# EAGLE design Xia_ENGI301_PCB (EAGLE 9.6.1)
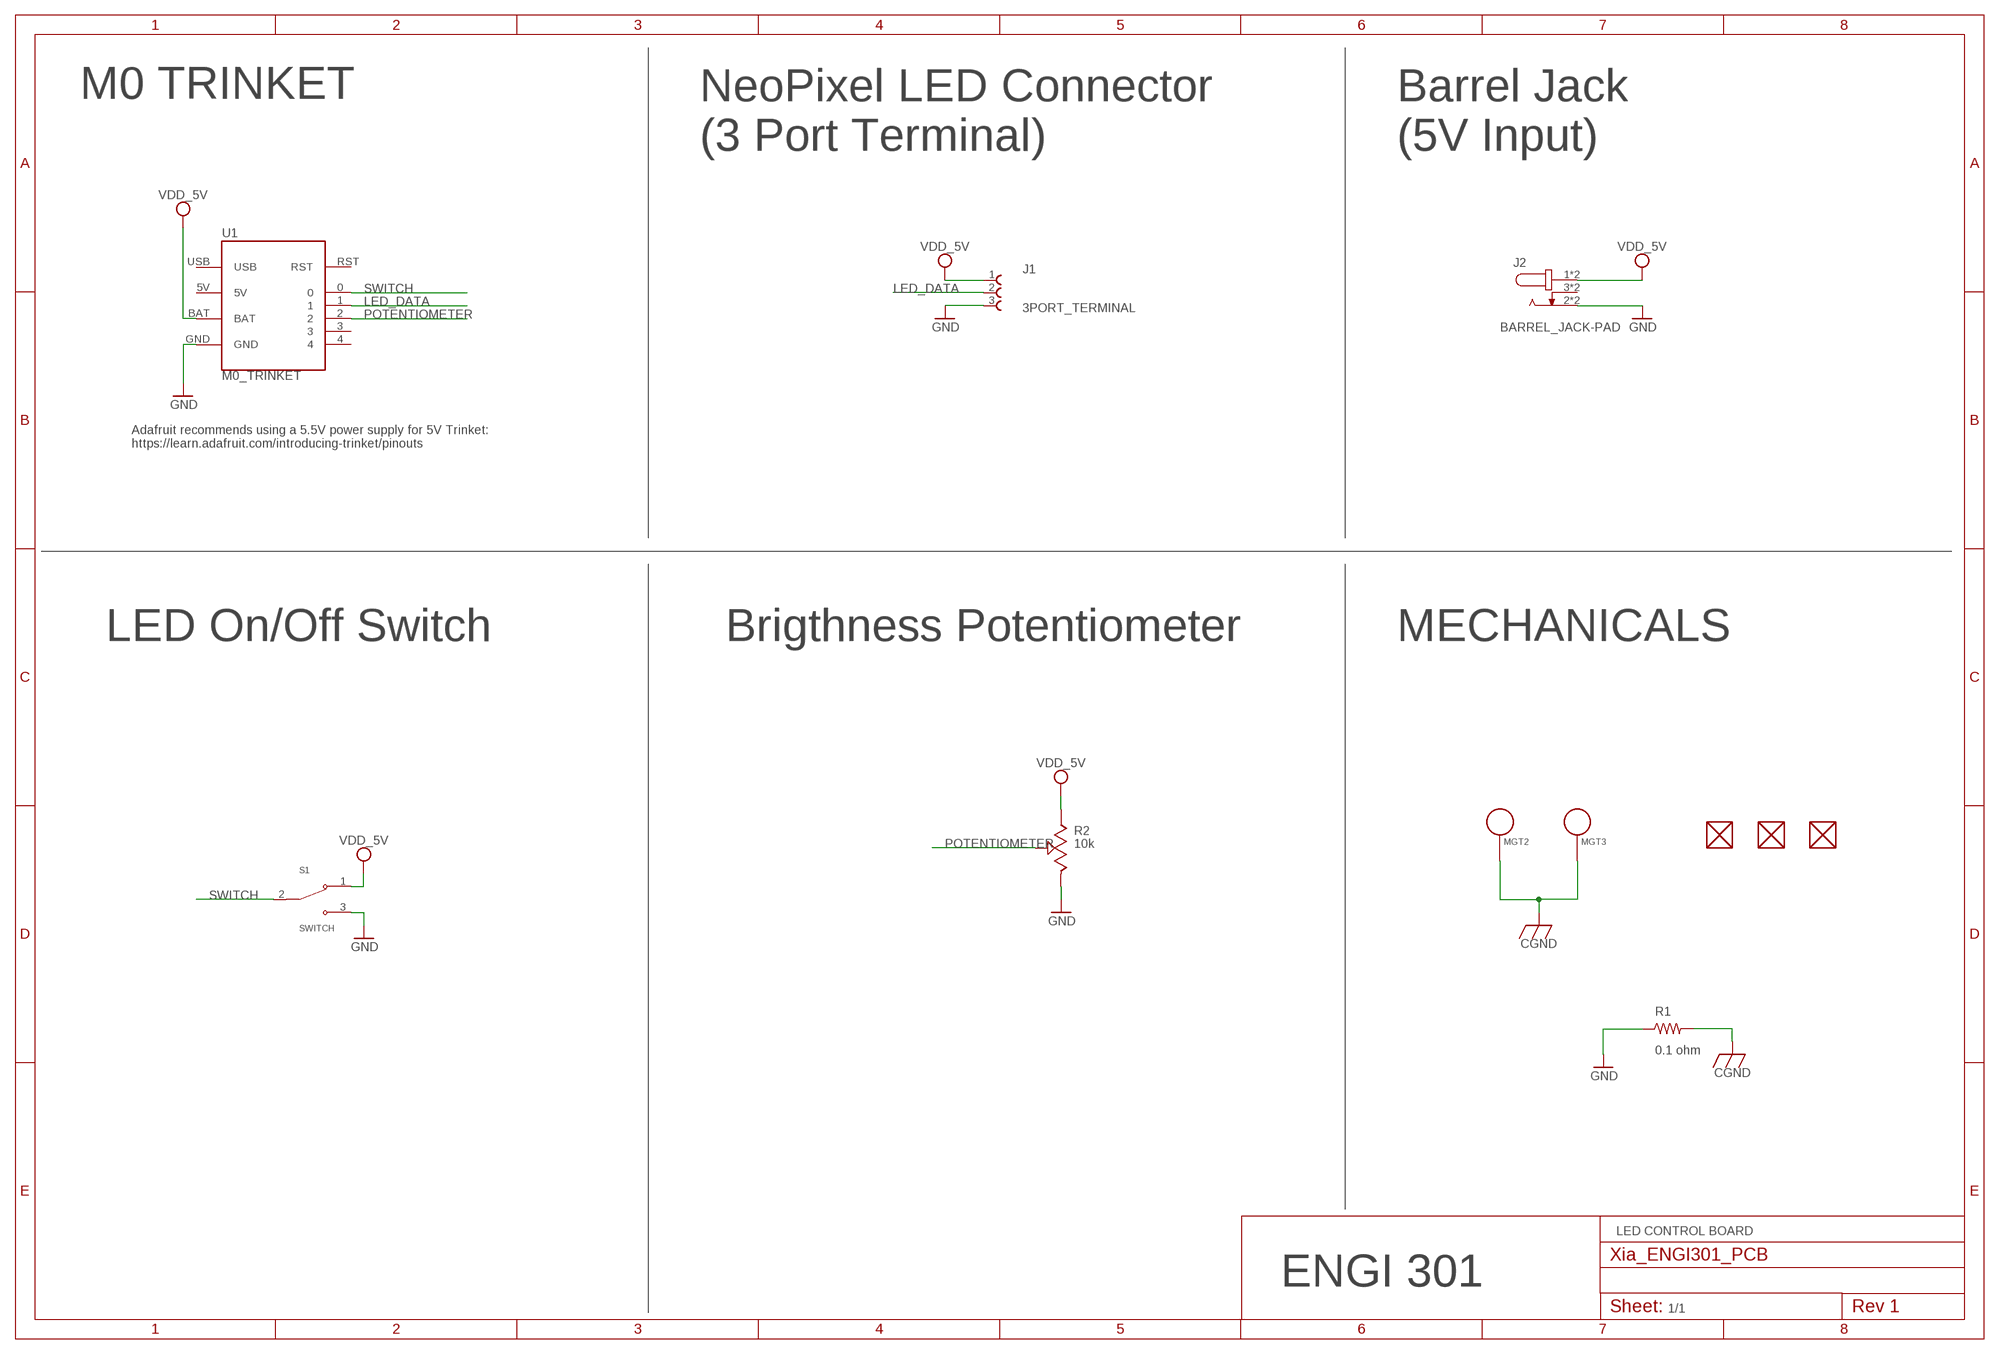
[diagram p0: schematic, sheet 1]

## Parts
FUD1  FIDUCIAL  [FIDUCIAL_40MIL]
FUD2  FIDUCIAL  [FIDUCIAL_40MIL]
FUD3  FIDUCIAL  [FIDUCIAL_40MIL]
J1  3PORT_TERMINAL  [3PORT_TERMINAL]
J2  BARREL_JACK-PAD  [BARREL_JACK]
MGT2  MOUNTING_HOLE  [MOUNTING_HOLE]
MGT3  MOUNTING_HOLE  [MOUNTING_HOLE]
R1  0.1 ohm  R-US_0207/10  [0207/10]
R2  10k  POTENTIOMETER  [POTENTIOMETER]
S1  SWITCH  [SWITCH]
U1  M0_TRINKET  [M0_TRINKET]

## Nets
CGND: MGT2.P$1 MGT3.P$1 R1.2
GND: J1.3 J2.2 J2.2_B R1.1 R2.3 S1.3 U1.GND
LED_DATA: J1.2 U1.1
POTENTIOMETER: R2.2 U1.2
SWITCH: S1.2 U1.0
VDD_5V: J1.1 J2.1 J2.1_B R2.1 S1.1 U1.BAT
Unconnected: FUD1.P$1 FUD2.P$1 FUD3.P$1 J2.3 J2.3_B U1.3 U1.4 U1.RST U1.USB

## Notes on the sheet
- M0 TRINKET
- NeoPixel LED Connector
  (3 Port Terminal)
- Barrel Jack
  (5V Input)
- Adafruit recommends using a 5.5V power supply for 5V Trinket:
  https://learn.adafruit.com/introducing-trinket/pinouts
- LED On/Off Switch | Brigthness Potentiometer | MECHANICALS
- LED CONTROL BOARD
- ENGI 301
- 1/1

## Power pins joined to a net without a drawn wire
5V: U1.5V

## Library data of the parts
FUD1-FUD3 = combo_lock:FIDUCIAL
J1 = Xia_ENGI301_PCB:3PORT_TERMINAL: SERIE 1377 - 5.00 MM - HORIZONTAL CABLE ENTRY WITH PRESSURE CLAMP - GLOW WIRE PLASTIC - WR-TBL <http://katalog.we-online.de/media/images/v2/Family_WR-TBL1_6911377100xx.jpg> Details see: http://katalog.we-online.de/en/em/TBL_5_00_1377_HORIZONTAL_ENTRY_W_PRESSURE_CLAMP_GLOW_WIRE_6911377100xx Created by Yingchun,Shan 2016(C) Wurth Elektronik Check availability <https://pricing.snapeda.com/parts/691137710003/Wurth%20Elektronik/view-part?ref=eda>; AVAILABILITY: In Stock; DESCRIPTION: 3 Position Wire to Board Terminal Block Horizontal with Board 0.197 (5.00mm) Through Hole; MF: Wurth Elektronik; MP: 691137710003; PACKAGE: None; PRICE: None; PURCHASE-URL: https://pricing.snapeda.com/search/part/691137710003/?ref=eda
J2 = Xia_ENGI301_PCB:BARREL_JACK: 2.5 mm Center Pin, 5.0 A, Right Angle, Through Hole, Tapered Pins, Dc Power Jack Connector; MANUFACTURER: CUI INC; PART_REV: 1.02; STANDARD: Manufacturer recommendations
MGT2 MGT3 = combo_lock:MOUNTING_HOLE: Chassis Mounting Hole w/GND connection ability
R1 = Xia_ENGI301_PCB:R-US_: RESISTOR, American symbol
R2 = Xia_ENGI301_PCB:POTENTIOMETER
S1 = Xia_ENGI301_PCB:SWITCH: Toggle Switch SPDT Through Hole Check availability <https://pricing.snapeda.com/parts/100SP1T1B4M2QE/E-Switch/view-part?ref=eda>; AVAILABILITY: In Stock; DESCRIPTION: Toggle Switch SPDT Through Hole; MF: E-Switch; MP: 100SP1T1B4M2QE; PACKAGE: None; PRICE: None; PURCHASE-URL: https://pricing.snapeda.com/search/part/100SP1T1B4M2QE/?ref=eda
U1 = Xia_ENGI301_PCB:M0_TRINKET

## Board
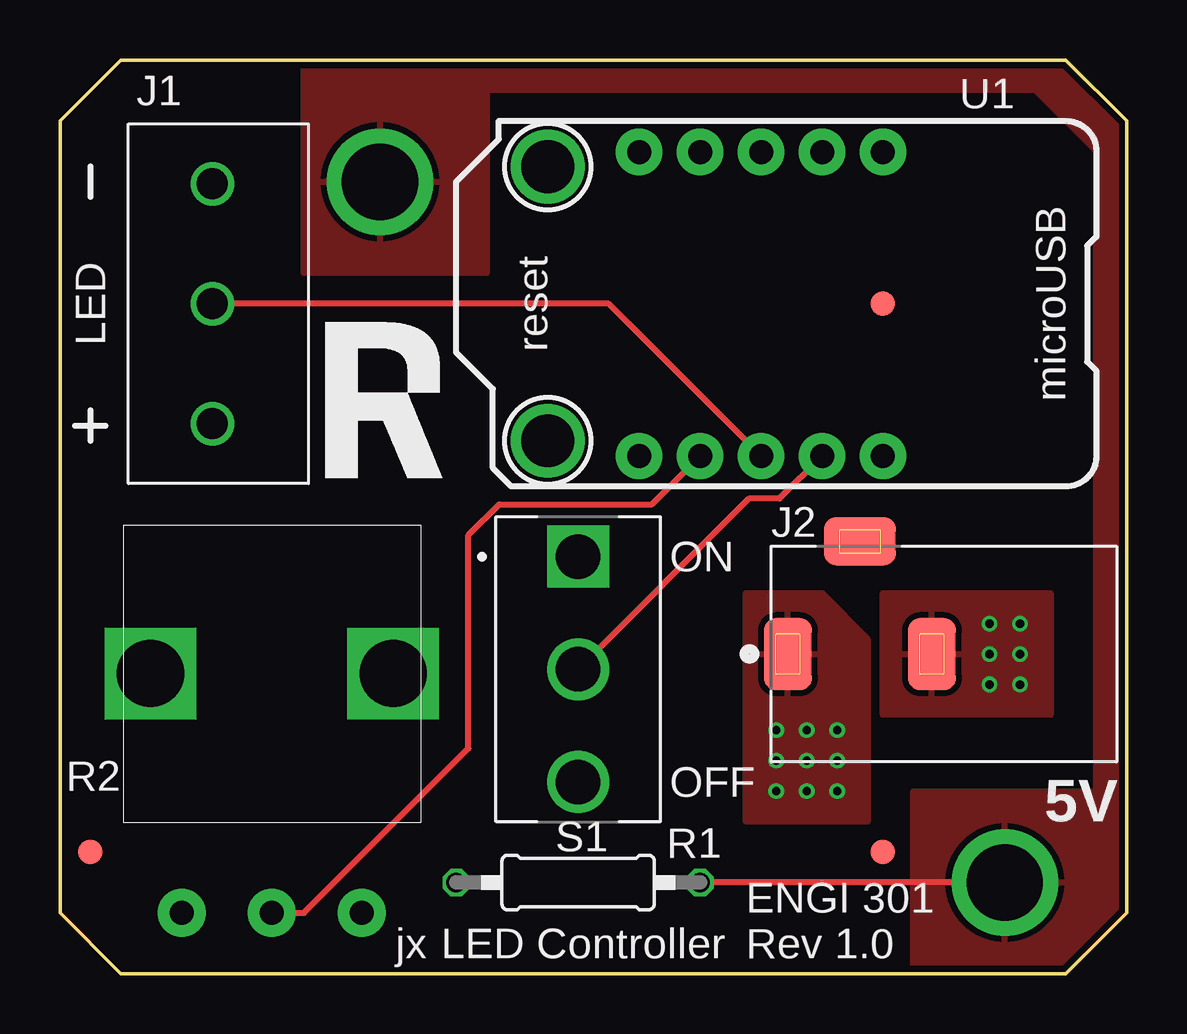
[diagram p1: board, top side]
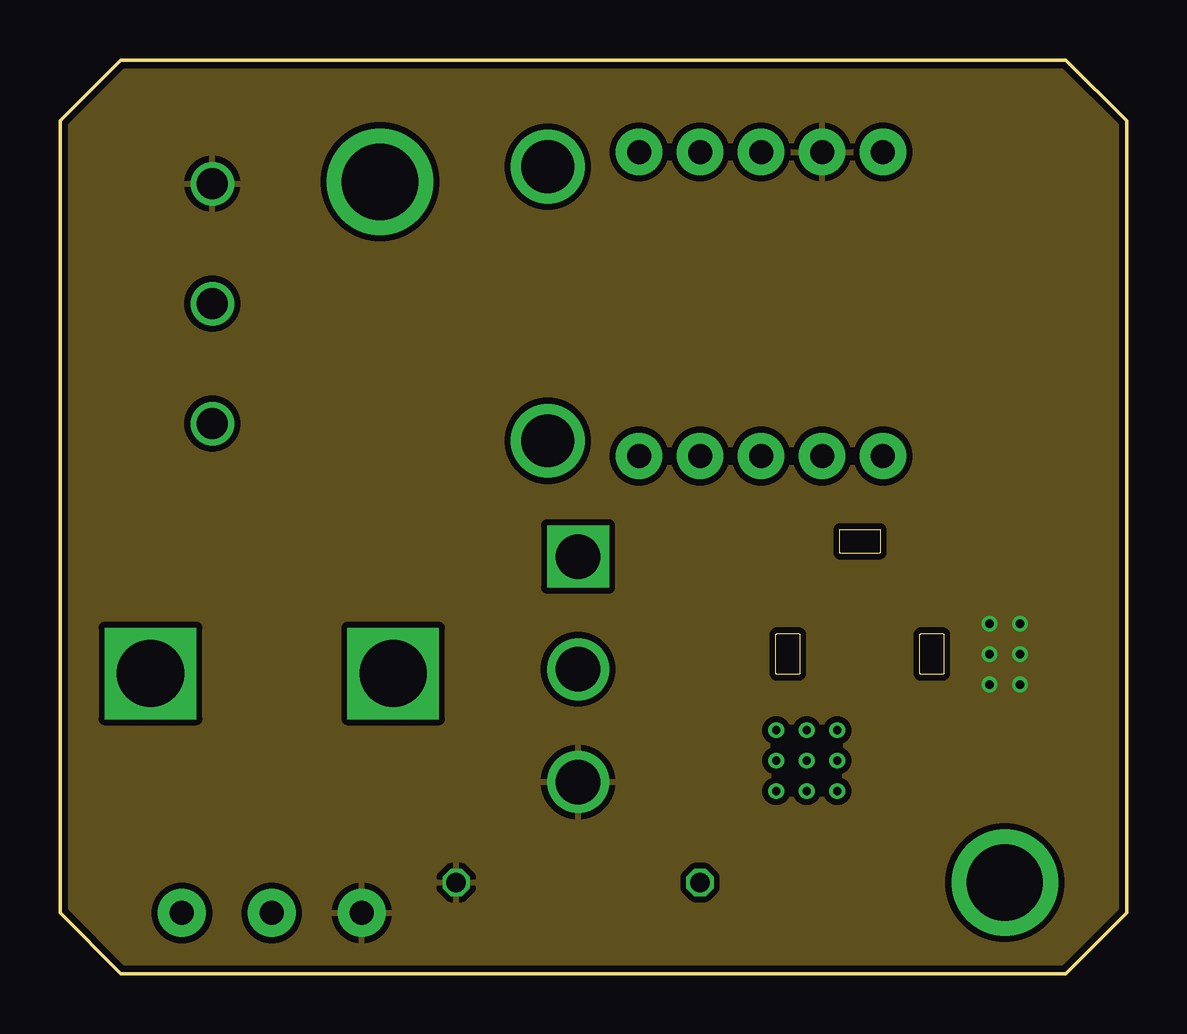
[diagram p2: board, inner layer Route2]
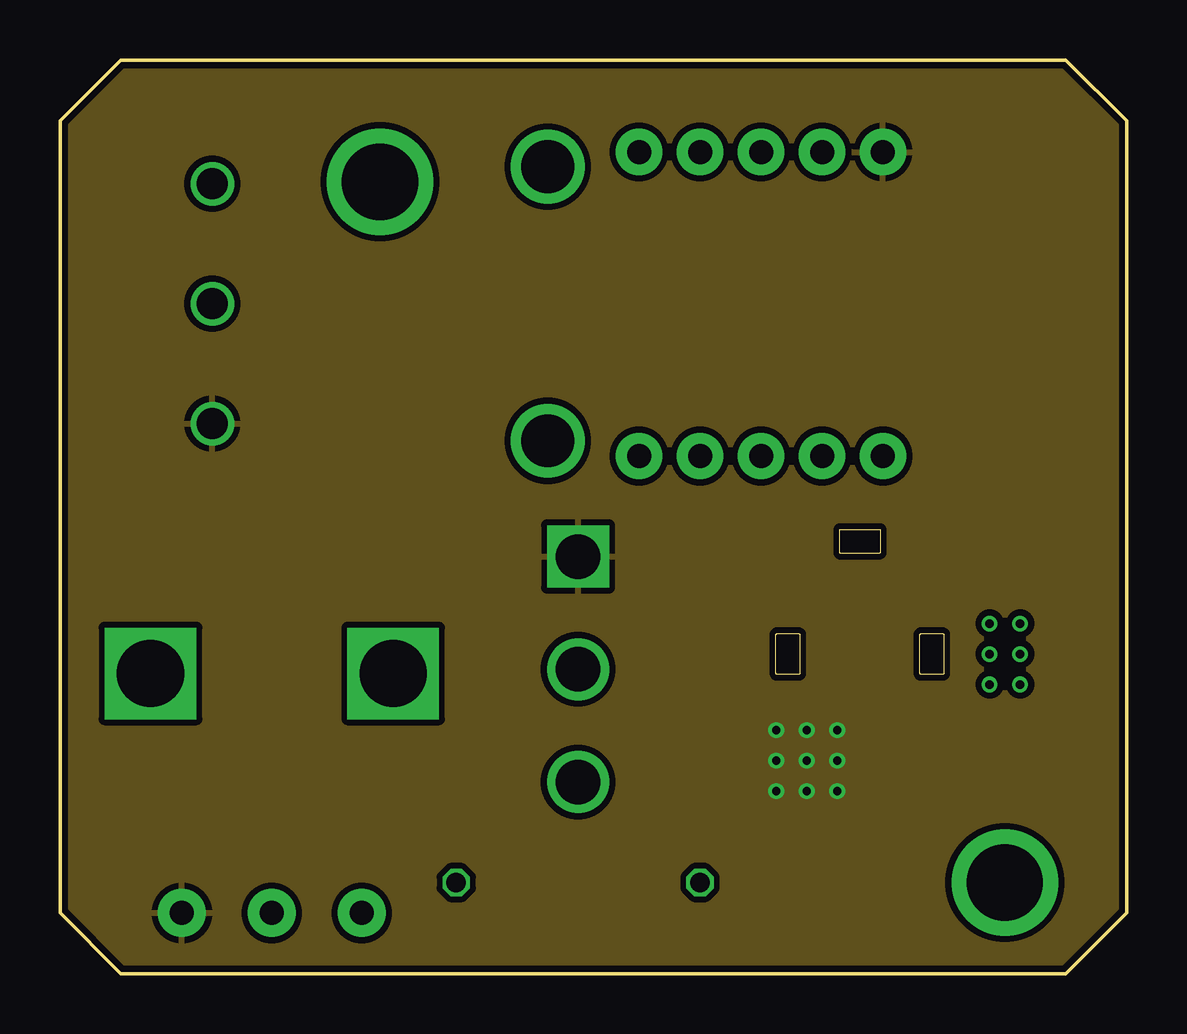
[diagram p3: board, inner layer Route15]
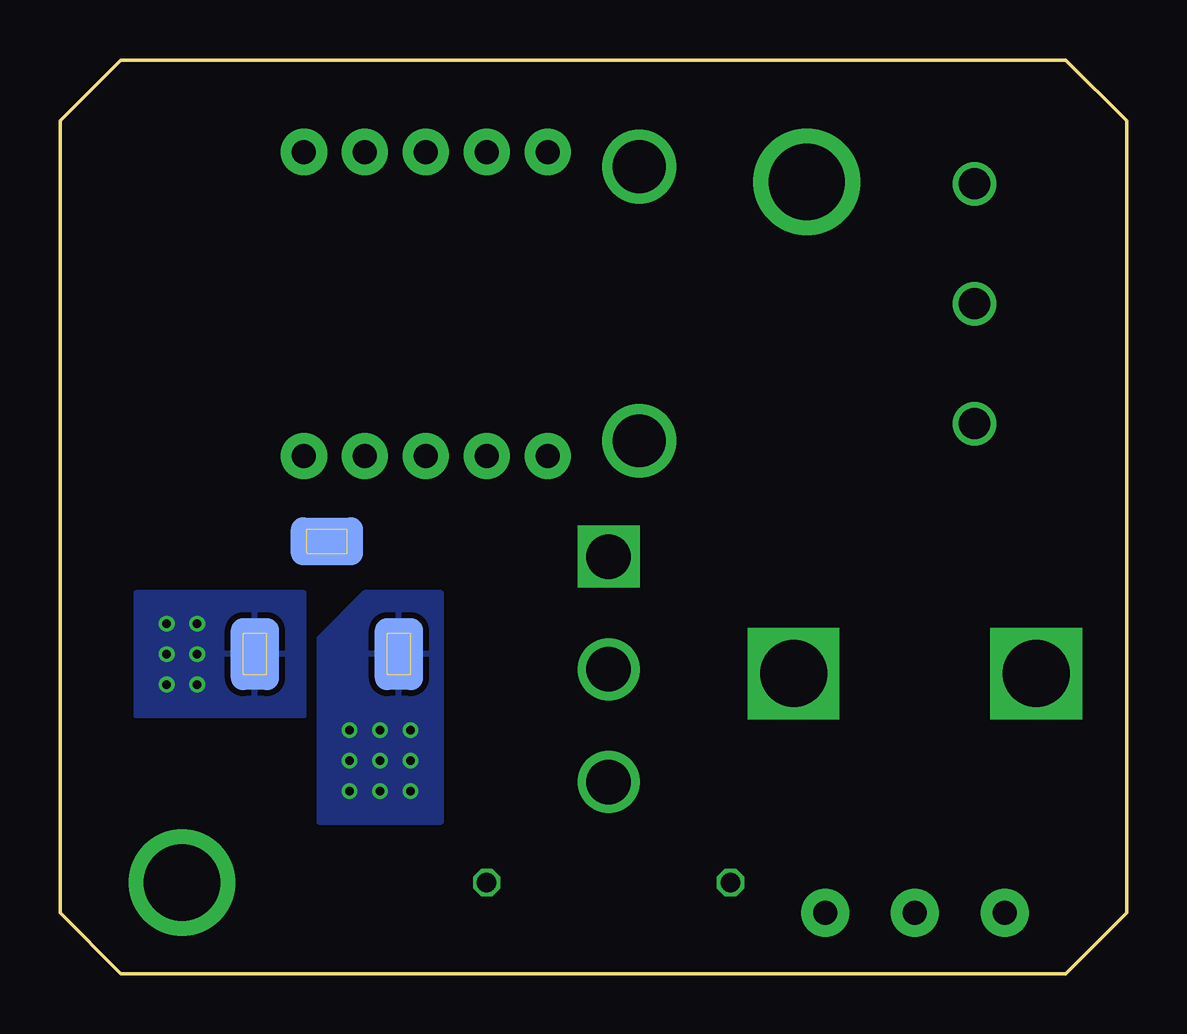
[diagram p4: board, bottom side, seen from below]

Size 44.45 x 38.1 mm. Coordinates in mm from the lower left corner, seen from the top.
Outline: 0,2.54 0,35.56 2.54,38.1 41.91,38.1 44.45,35.56 44.45,2.54 41.91,0 2.54,0 0,2.54
Copper layers (1*2*15*16): Top 0.035mm / dielectric 0.23mm / Route2 0.035mm / dielectric 0.93mm / Route15 0.035mm / dielectric 0.23mm / Bottom 0.035mm
Design rules "ENGI301_4lyr": minimum track width 10mil, minimum drill 12mil, track to track 10mil, track to pad 10mil, pad to pad 10mil, via to via 10mil, smd to smd 10mil, copper to edge 10mil, drill to drill 12mil, minimum pad ring 6mil, minimum via ring 6mil, stop-mask expansion 3mil, vias tented up to drill 25mil, thermal gap 10mil

### Footprints (pad centres in the part's own frame; a part is rotated, then mirrored left to right if it is on the bottom)
FIDUCIAL_40MIL = smd 1.016 x 1.016: P$1 0,0
3PORT_TERMINAL = drill 1.3: 1 -5,0; 2 0,0; 3 5,0
BARREL_JACK = smd 2 x 3: 1 -6.5,0; 2 -0.5,0 | smd 2 x 3 bottom: 1_B -6.5,0; 2_B -0.5,0 | smd 3 x 2: 3 -3.5,4.7 | smd 3 x 2 bottom: 3_B -3.5,4.7
MOUNTING_HOLE = drill 3.175 pad 4.445: P$1 0,0
0207/10 = drill 0.813 octagon: 1 -5.08,0; 2 5.08,0
POTENTIOMETER = drill 1 pad 2: 1 0,0; 2 3.747,0; 3 7.493,0 | drill 2.8 square: CLAMP1 -1.308,9.982; CLAMP2 8.801,9.982
SWITCH = drill 1.85 square: 1 0,4.7 | drill 1.85: 2 0,0; 3 0,-4.7
M0_TRINKET = drill 1 pad 1.93: 0 6.35,1.27; 1 6.35,-1.27; 2 6.35,-3.81; 3 -6.325,-3.81; 4 -6.325,-1.27; 5V 6.35,-6.35; BAT -6.325,3.81; GND -6.325,1.27; RST -6.325,-6.35; USB 6.35,3.81 | drill 2.2 pad 3: LEFT_HOLE -5.715,-10.16; RIGHT_HOLE 5.715,-10.16

### Placement (x,y rotation side)
FUD1  1.27,5.08 0 top
FUD2  34.29,5.08 0 top
FUD3  34.29,27.94 0 top
J1  6.35,27.94 90 top
J2  36.83,13.34 0 top
MGT2  13.34,33.02 0 top
MGT3  39.37,3.81 0 top
R1  21.59,3.81 0 top
R2  5.08,2.54 0 top
S1  21.59,12.7 0 top
U1  30.48,27.94 270 top

### Tracks (layer width: path | path; a pad name or v marks a point on that pad's centre or on a via)
CGND
  Top 0.254: MGT3.P$1 R1.2
  pour Top: 35.56,-1.27 35.56,7.62 43.18,7.62 43.18,34.29 40.64,36.83 17.78,36.83 17.78,29.21 10.16,29.21 10.16,39.37 45.72,39.37 45.72,-1.27
GND  (via drill 0.35)
  other vias: 40.01,12.06 38.73,12.06 38.73,13.34 38.73,14.61 40.01,13.34 40.01,14.61
  pour Route2 (rank 6): -2.54,-2.54 -2.54,40.64 46.99,40.64 46.99,-2.54
  pour Top: 34.29,10.79 34.29,15.88 41.27,15.88 41.27,10.79
  pour Bottom: 34.29,10.79 34.29,15.88 41.27,15.88 41.27,10.79
LED_DATA
  Top 0.254: U1.1 22.86,27.94 J1.2
POTENTIOMETER
  Top 0.254: R2.2 10.16,2.54 17.02,9.4 17.02,18.29 18.3,19.57 24.65,19.57 U1.2
SWITCH
  Top 0.254: U1.0 29.97,19.81 28.7,19.81 S1.2
VDD_5V  (via drill 0.35)
  other vias: 29.84,10.16 31.11,10.16 32.38,10.16 32.38,8.89 31.11,8.89 29.84,8.89 29.84,7.62 31.11,7.62 32.38,7.62
  pour Route15 (rank 6): -5.08,-5.08 -5.08,43.18 49.53,43.18 49.53,-5.08
  pour Top: 28.57,6.35 28.57,15.88 31.75,15.88 33.66,13.97 33.66,6.35
  pour Bottom: 28.57,6.35 28.57,15.88 31.75,15.88 33.66,13.97 33.66,6.35

### Text on the board
tPlace: LED | ON | OFF | 5V | ENGI 301 | jx | LED Controller | Rev 1.0